# Altium schematic sheet AGCCAL_Top_Level.SchDoc
size A4
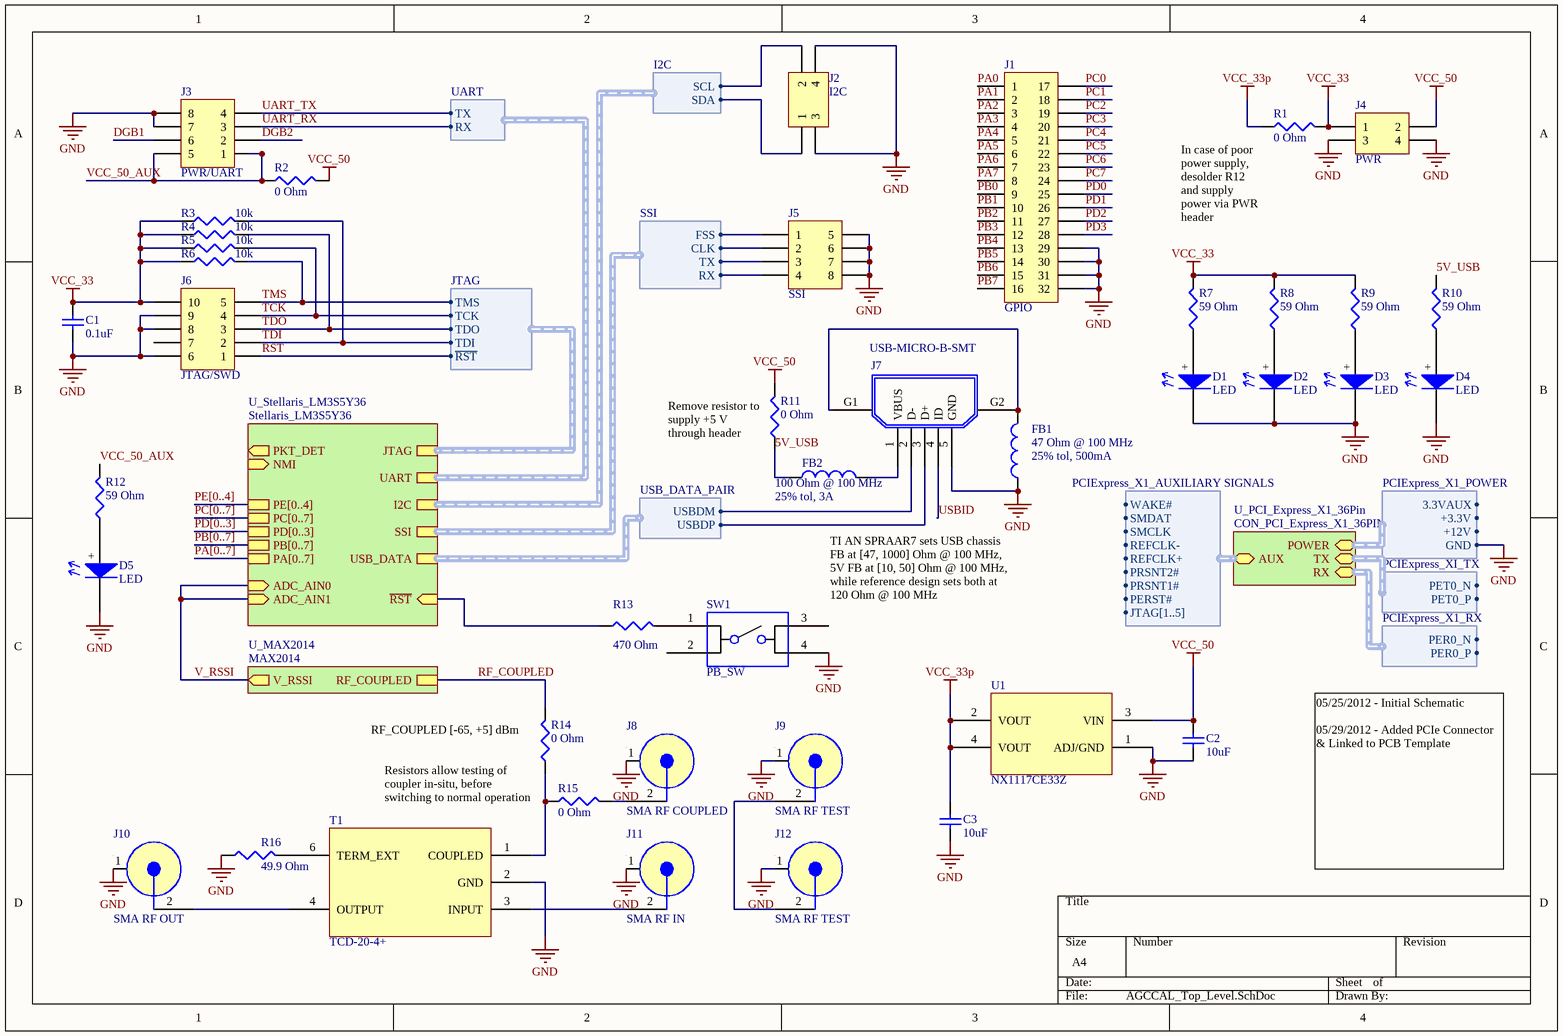
[diagram p0: AGCCAL_Top_Level.SchDoc]

## Parts
C1  value 0.1uF  [1608[0603]]  (hidden comment: Cap Semi)
C2  value 10uF  [C1206]  (hidden comment: Cap Semi)
C3  value 10uF  [C1206]  (hidden comment: Cap Semi)
D1  LED  [0603_SMT_POLAR]
D2  LED  [0603_SMT_POLAR]
D3  LED  [0603_SMT_POLAR]
D4  LED  [0603_SMT_POLAR]
D5  LED  [0603_SMT_POLAR]
FB1  25% tol, 500mA  value 47 Ohm @ 100 MHz  [0603_SMT]
FB2  25% tol, 3A  value 100 Ohm @ 100 MHz  [0603_SMT]
J1  GPIO  [2.54mm_16x2_HDR]
J2  I2C  [2.54mm_2x2_HDR]
J3  PWR/UART  [1.27mm_2x4_SMT_HDR]
J4  PWR  [HDR2X2]
J5  SSI  [2.54mm_4x2_HDR]
J6  JTAG/SWD  [1.27mm_2x5_SMT_HDR]
J7  USB-MICRO-B-SMT  [USB_MICROB_SMT_R2]
J8  SMA RF COUPLED  [SMA-JACK-THROUGH-MOLEX_5]
J9  SMA RF TEST  [SMA-JACK-THROUGH-MOLEX_5]
J10  SMA RF OUT  [SMA-JACK-THROUGH-MOLEX_5]
J11  SMA RF IN  [SMA-JACK-THROUGH-MOLEX_5]
J12  SMA RF TEST  [SMA-JACK-THROUGH-MOLEX_5]
R1  value 0 Ohm  [0805_SMT]
R2  value 0 Ohm  [0805_SMT]  (hidden comment: Res3)
R3  value 10k  [J1-0603]  (hidden comment: Res3)
R4  value 10k  [J1-0603]  (hidden comment: Res3)
R5  value 10k  [J1-0603]  (hidden comment: Res3)
R6  value 10k  [J1-0603]  (hidden comment: Res3)
R7  value 59 Ohm  [J1-0603]  (hidden comment: Res3)
R8  value 59 Ohm  [J1-0603]  (hidden comment: Res3)
R9  value 59 Ohm  [J1-0603]  (hidden comment: Res3)
R10  value 59 Ohm  [J1-0603]  (hidden comment: Res3)
R11  value 0 Ohm  [0805_SMT]
R12  value 59 Ohm  [J1-0603]  (hidden comment: Res3)
R13  value 470 Ohm  [J1-0603]
R14  value 0 Ohm  [0805_SMT]  (hidden comment: Res3)
R15  value 0 Ohm  [0805_SMT]  (hidden comment: Res3)
R16  value 49.9 Ohm  [0805_SMT]  (hidden comment: Res3)
SW1  PB_SW  [PUSHBUTTON_SW2_SMT]
T1  TCD-20-4+  [DB714-MINICIRCUITS]
U1  NX1117CE33Z  [NX1117CE33Z-SOT223]

## Sub-sheets
U_MAX2014 = MAX2014: V_RSSI (out), RF_COUPLED
U_PCI_Express_X1_36Pin = CON_PCI_Express_X1_36PIN: POWER (harness PCIExpress_X1_POWER), TX (harness PCIExpress_XI_TX), AUX (harness PCIExpress_X1_AUXILIARY SIGNALS), RX (harness PCIExpress_X1_RX)
U_Stellaris_LM3S5Y36 = Stellaris_LM3S5Y36: SSI (harness SSI), USB_DATA (harness USB_DATA_PAIR), UART (harness UART), ADC_AIN0 (in), ADC_AIN1 (in), NMI (in), PKT_DET (out), I2C (harness I2C), JTAG (harness JTAG), PA[0..7], PB[0..7], PC[0..7], PD[0..3], PE[0..4], ~{RST} (in)

## Harnesses
JTAG: ~{RST}, TCK, TDI, TDO, TMS
UART: RX, TX
I2C: SCL, SDA
SSI: FSS, CLK, TX, RX
USB_DATA_PAIR: USBDM, USBDP
PCIExpress_XI_TX: PET0_N, PET0_P
PCIExpress_X1_RX: PER0_N, PER0_P
PCIExpress_X1_POWER: 3.3VAUX, +3.3V, +12V, GND
PCIExpress_X1_AUXILIARY SIGNALS: JTAG[1..5], PERST#, PRSNT1#, PRSNT2#, REFCLK+, REFCLK-, SMCLK, SMDAT, WAKE#

## Nets
GND: C1.1 C2.1 C3.1 D1.-(Cathode) D2.-(Cathode) D3.-(Cathode) D4.-(Cathode) D5.-(Cathode) FB1.1 J1.29 J1.30 J1.31 J1.32 J2.3 J2.4 J3.7 J3.8 J4.3 J4.4 J5.5 J5.6 J5.7 J5.8 J6.6 J6.8 J6.9 J7.5(GND) J8.1(GND) J9.1(GND) J10.1(GND) J11.1(GND) J12.1(GND) R16.1 SW1.4 T1.2(GND) U1.1(ADJ/GND) ; sheet U_PCI_Express_X1_36Pin/POWER.GND
VCC_33: C1.2 J4.1 J6.10 R1.2 R3.1 R4.1 R5.1 R6.1 R7.2 R8.2 R9.2
VCC_33p: C3.2 R1.1 U1.2(VOUT) U1.4(VOUT)
VCC_50: C2.2 J4.2 R2.2 R11.2 U1.3(VIN)
5V_USB: FB2.1 R10.2 R11.1
~{RST}: J6.1 ; sheet U_Stellaris_LM3S5Y36/JTAG.~{RST}
DGB1: J3.6
DGB2: J3.2
PA0: J1.1
PA1: J1.2
PA2: J1.3
PA3: J1.4
PA4: J1.5
PA5: J1.6
PA6: J1.7
PA7: J1.8
PB0: J1.9
PB1: J1.10
PB2: J1.11
PB3: J1.12
PB4: J1.13
PB5: J1.14
PB6: J1.15
PB7: J1.16
PC0: J1.17
PC1: J1.18
PC2: J1.19
PC3: J1.20
PC4: J1.21
PC5: J1.22
PC6: J1.23
PC7: J1.24
PD0: J1.25
PD1: J1.26
PD2: J1.27
PD3: J1.28
RF_COUPLED: R14.2 ; sheet U_MAX2014/RF_COUPLED
TCK: J6.4 R5.2 ; sheet U_Stellaris_LM3S5Y36/JTAG.TCK
TDI: J6.2 R3.2 ; sheet U_Stellaris_LM3S5Y36/JTAG.TDI
TDO: J6.3 R4.2 ; sheet U_Stellaris_LM3S5Y36/JTAG.TDO
TMS: J6.5 R6.2 ; sheet U_Stellaris_LM3S5Y36/JTAG.TMS
UART_RX: J3.3 ; sheet U_Stellaris_LM3S5Y36/UART.RX
UART_TX: J3.4 ; sheet U_Stellaris_LM3S5Y36/UART.TX
USBID: J7.4(ID)
V_RSSI: sheet U_MAX2014/V_RSSI, sheet U_Stellaris_LM3S5Y36/ADC_AIN0, sheet U_Stellaris_LM3S5Y36/ADC_AIN1
VCC_50_AUX: J3.1 J3.5 R2.1 R12.2
NetD1_+: D1.+(Anode) R7.1
NetD2_+: D2.+(Anode) R8.1
NetD3_+: D3.+(Anode) R9.1
NetD4_+: D4.+(Anode) R10.1
NetD5_+: D5.+(Anode) R12.1
NetFB1_2: FB1.2 J7.G1 J7.G2
NetFB2_2: FB2.2 J7.1(VBUS)
NetJ2_1: J2.1 ; sheet U_Stellaris_LM3S5Y36/I2C.SDA
NetJ2_2: J2.2 ; sheet U_Stellaris_LM3S5Y36/I2C.SCL
NetJ5_1: J5.1 ; sheet U_Stellaris_LM3S5Y36/SSI.FSS
NetJ5_2: J5.2 ; sheet U_Stellaris_LM3S5Y36/SSI.CLK
NetJ5_3: J5.3 ; sheet U_Stellaris_LM3S5Y36/SSI.TX
NetJ5_4: J5.4 ; sheet U_Stellaris_LM3S5Y36/SSI.RX
NetJ7_2: J7.2(D-) ; sheet U_Stellaris_LM3S5Y36/USB_DATA.USBDM
NetJ7_3: J7.3(D+) ; sheet U_Stellaris_LM3S5Y36/USB_DATA.USBDP
NetJ8_2: J8.2 R15.2
NetJ9_2: J9.2 J12.2
NetJ10_2: J10.2 T1.4(OUTPUT)
NetJ11_2: J11.2 T1.3(INPUT)
NetR13_1: R13.1 ; sheet U_Stellaris_LM3S5Y36/~{RST}
NetR13_2: R13.2 SW1.1
NetR14_1: R14.1 R15.1 T1.1(COUPLED)
NetR16_2: R16.2 T1.6(TERM_EXT)

Not connected (* = marked no-connect by the designer): J6 7; SW1 2 3; T1 5(NOT_USED)

## Buses and harness runs
bus PA[0..7] = sheet U_Stellaris_LM3S5Y36/PA[0..7]
bus PB[0..7] = sheet U_Stellaris_LM3S5Y36/PB[0..7]
bus PC[0..7] = sheet U_Stellaris_LM3S5Y36/PC[0..7]
bus PD[0..3] = sheet U_Stellaris_LM3S5Y36/PD[0..3]
bus PE[0..4] = sheet U_Stellaris_LM3S5Y36/PE[0..4]

## Notes on the sheet
- (near R1) Text
- (near R1) In case of poor power supply, desolder R12 and supply power via PWR header
- (near R11) Remove resistor to supply +5 V through header
- TI AN SPRAAR7 sets USB chassis FB at [47, 1000] Ohm @ 100 MHz, 5V FB at [10, 50] Ohm @ 100 MHz, while reference design sets both at 120 Ohm @ 100 MHz
- (near R14) RF_COUPLED [-65, +5] dBm
- (near R14) Resistors allow testing of coupler in-situ, before switching to normal operation
- 05/25/2012 - Initial Schematic
  05/29/2012 - Added PCIe Connector & Linked to PCB Template

## Library data of the parts
C1-C3 = Cap Semi: Capacitor (Semiconductor SIM Model); Published: 8-Jun-2000; LatestRevisionDate: 29-May-2009; LatestRevisionNote: IPC-7351 Footprint Added.; PackageReference: C1206; Publisher: Altium Limited; PackageDescription: Chip Capacitor
FB1 FB2 = Inductor: Code_IEC: 1005; Published: 8-Jun-2000; LatestRevisionDate: 29-May-2009; LatestRevisionNote: IPC-7351 Footprint Added.; PackageReference: 0402-A; Publisher: Altium Limited; PackageDescription: Chip Inductor; Code_JEITA: 0402
J1 = Header 16X2A: Header, 16-Pin, Dual row; LatestRevisionDate: 17-Jul-2002; LatestRevisionNote: Re-released for DXP Platform.; Publisher: Altium Limited
J2 J4 = Header 2X2: Header, 2-Pin, Dual row; LatestRevisionDate: 17-Jul-2002; LatestRevisionNote: Re-released for DXP Platform.; Publisher: Altium Limited
J3 J5 = Header 4X2A: Header, 4-Pin, Dual row; LatestRevisionDate: 17-Jul-2002; LatestRevisionNote: Re-released for DXP Platform.; Publisher: Altium Limited
J6 = Header 5X2A: Header, 5-Pin, Dual row; LatestRevisionDate: 17-Jul-2002; LatestRevisionNote: Re-released for DXP Platform.; Publisher: Altium Limited
J8 = SMA-THROUGH-MOUNT: RF Coupled
J9-J12 = SMA-THROUGH-MOUNT
R1-R16 = Res3: Resistor; Published: 8-Jun-2000; LatestRevisionDate: 29-May-2009; LatestRevisionNote: IPC-7351 Footprint Added.; PackageReference: J1-0603; Publisher: Altium Limited; PackageDescription: Chip Resistor
SW1 = SMT-PUSHBUTTON-SW: Pushbutton Switch